# Altium schematic sheet MCU.SchDoc: AusBubble : Logic & RF : MCU
size A4; DrawnBy: WR, ND; DocumentNumber: 2; Revision: A; SheetNumber: 2; SheetTotal: 5
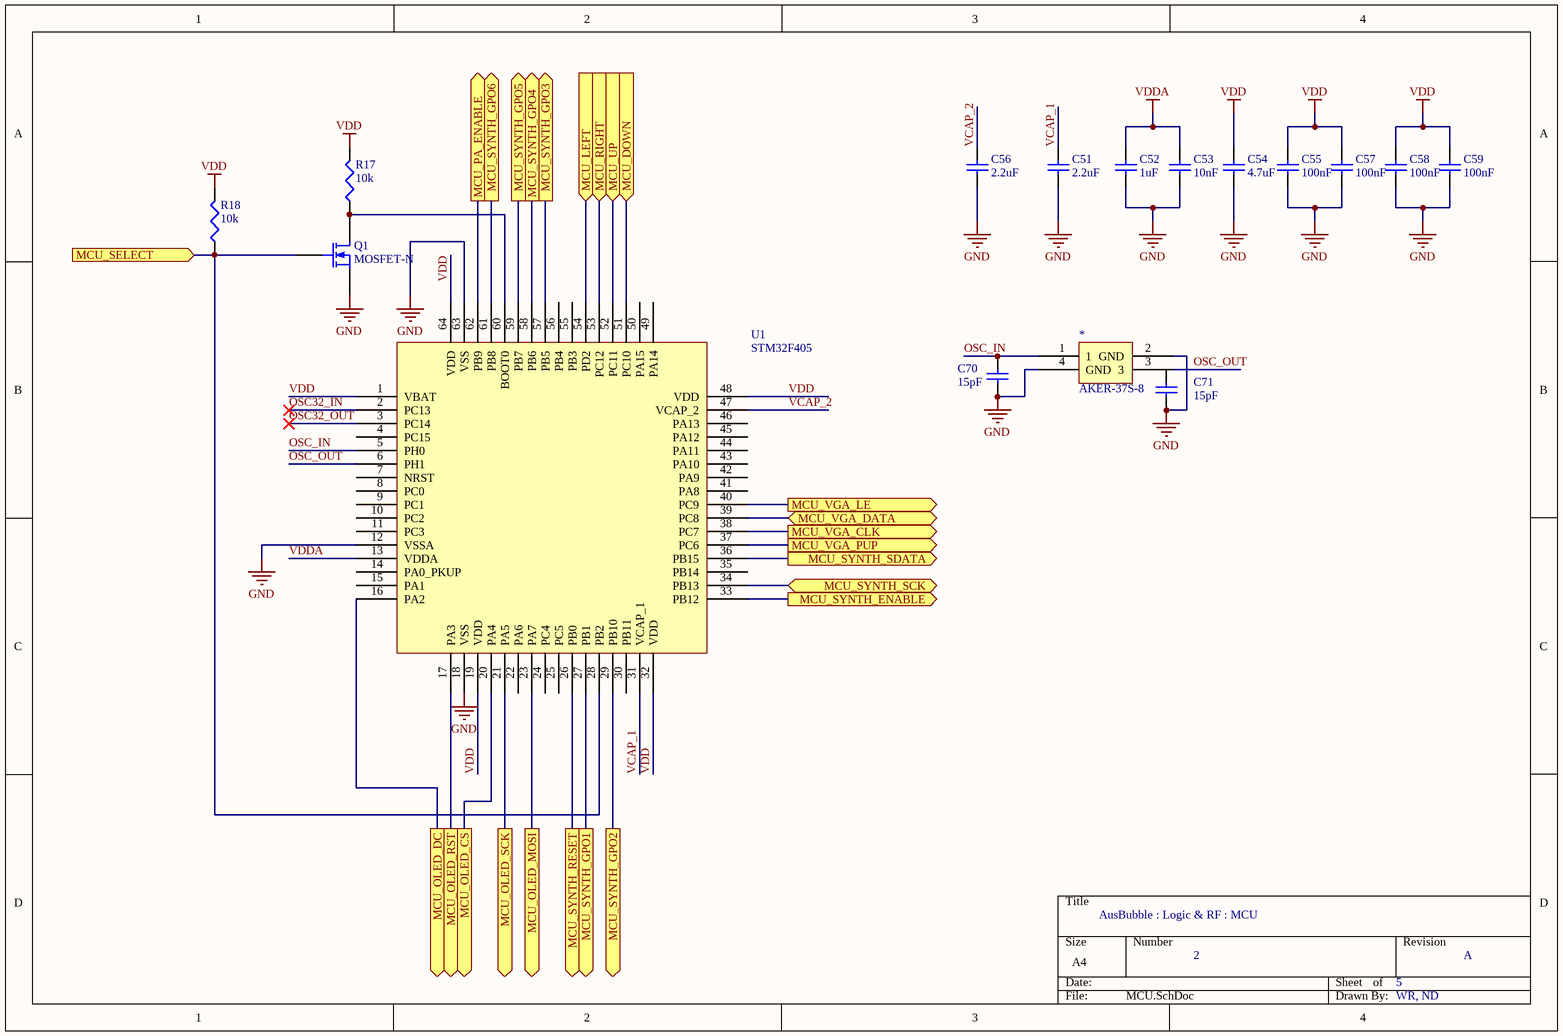
[diagram p0: MCU.SchDoc]

## Parts
*  AKER-37S-8  [AKER-37S]
C51  value 2.2uF  [1608[0603]]  (hidden comment: Cap Semi)
C52  value 1uF  [1608[0603]]  (hidden comment: Cap Semi)
C53  value 10nF  [1608[0603]]  (hidden comment: Cap Semi)
C54  value 4.7uF  [1608[0603]]  (hidden comment: Cap Semi)
C55  value 100nF  [1608[0603]]  (hidden comment: Cap Semi)
C56  value 2.2uF  [1608[0603]]  (hidden comment: Cap Semi)
C57  value 100nF  [1608[0603]]  (hidden comment: Cap Semi)
C58  value 100nF  [1608[0603]]  (hidden comment: Cap Semi)
C59  value 100nF  [1608[0603]]  (hidden comment: Cap Semi)
C70  value 15pF  [0402]  (hidden comment: Cap Semi)
C71  value 15pF  [0402]  (hidden comment: Cap Semi)
Q1  MOSFET-N  [SOT95P230-3M]
R17  value 10k  [J1-0603]  (hidden comment: Res3)
R18  value 10k  [J1-0603]  (hidden comment: Res3)
U1  STM32F405  [SQFP50P1200X1200-64L]

## Ports
MCU_DOWN (in), MCU_LEFT (in), MCU_OLED_CS (out), MCU_OLED_DC (out), MCU_OLED_MOSI (out), MCU_OLED_RST (out), MCU_OLED_SCK (out), MCU_PA_ENABLE (out), MCU_RIGHT (in), MCU_SELECT (in), MCU_SYNTH_ENABLE (out), MCU_SYNTH_GPO1 (out), MCU_SYNTH_GPO2 (out), MCU_SYNTH_GPO3 (out), MCU_SYNTH_GPO4 (out), MCU_SYNTH_GPO5 (out), MCU_SYNTH_GPO6 (out), MCU_SYNTH_RESET (out), MCU_SYNTH_SCK (bidir), MCU_SYNTH_SDATA (out), MCU_UP (in), MCU_VGA_CLK (out), MCU_VGA_DATA (bidir), MCU_VGA_LE (out), MCU_VGA_PUP (out)

## Nets
GND: *.2(GND) *.4(GND) C51.1 C52.1 C53.1 C54.1 C55.1 C56.1 C57.1 C58.1 C59.1 C70.1 C71.1 Q1.3(S) U1.12(VSSA) U1.18(VSS) U1.63(VSS)
VDD: C54.2 C55.2 C57.2 C58.2 C59.2 R17.2 R18.2 U1.1(VBAT) U1.19(VDD) U1.32(VDD) U1.48(VDD) U1.64(VDD)
VDDA: C52.2 C53.2 U1.13(VDDA)
MCU_DOWN: U1.51(PC10) ; port MCU_DOWN
MCU_LEFT: U1.54(PD2) ; port MCU_LEFT
MCU_OLED_CS: U1.20(PA4) ; port MCU_OLED_CS
MCU_OLED_DC: U1.16(PA2) ; port MCU_OLED_DC
MCU_OLED_MOSI: U1.23(PA7) ; port MCU_OLED_MOSI
MCU_OLED_RST: U1.17(PA3) ; port MCU_OLED_RST
MCU_OLED_SCK: U1.21(PA5) ; port MCU_OLED_SCK
MCU_PA_ENABLE: U1.62(PB9) ; port MCU_PA_ENABLE
MCU_RIGHT: U1.53(PC12) ; port MCU_RIGHT
MCU_SELECT: Q1.2(G) R18.1 U1.28(PB2) ; port MCU_SELECT
MCU_SYNTH_ENABLE: U1.33(PB12) ; port MCU_SYNTH_ENABLE
MCU_SYNTH_GPO1: U1.27(PB1) ; port MCU_SYNTH_GPO1
MCU_SYNTH_GPO2: U1.29(PB10) ; port MCU_SYNTH_GPO2
MCU_SYNTH_GPO3: U1.57(PB5) ; port MCU_SYNTH_GPO3
MCU_SYNTH_GPO4: U1.58(PB6) ; port MCU_SYNTH_GPO4
MCU_SYNTH_GPO5: U1.59(PB7) ; port MCU_SYNTH_GPO5
MCU_SYNTH_GPO6: U1.61(PB8) ; port MCU_SYNTH_GPO6
MCU_SYNTH_RESET: U1.26(PB0) ; port MCU_SYNTH_RESET
MCU_SYNTH_SCK: U1.34(PB13) ; port MCU_SYNTH_SCK
MCU_SYNTH_SDATA: U1.36(PB15) ; port MCU_SYNTH_SDATA
MCU_UP: U1.52(PC11) ; port MCU_UP
MCU_VGA_CLK: U1.38(PC7) ; port MCU_VGA_CLK
MCU_VGA_DATA: U1.39(PC8) ; port MCU_VGA_DATA
MCU_VGA_LE: U1.40(PC9) ; port MCU_VGA_LE
MCU_VGA_PUP: U1.37(PC6) ; port MCU_VGA_PUP
OSC32_IN: U1.2(PC13)
OSC32_OUT: U1.3(PC14)
OSC_IN: *.1 C70.2 U1.5(PH0)
OSC_OUT: *.3 U1.6(PH1)
VCAP_1: C51.2 U1.31(VCAP_1)
VCAP_2: C56.2 U1.47(VCAP_2)
NetQ1_1: Q1.1(D) R17.1 U1.60(BOOT0)

Not connected (* = marked no-connect by the designer): C71 2; U1 4(PC15) 7(NRST) 8(PC0) 9(PC1) 10(PC2) 11(PC3) 14(PA0_PKUP) 15(PA1) 22(PA6) 24(PC4) 25(PC5) 30(PB11) 35(PB14) 41(PA8) 42(PA9) 43(PA10) 44(PA11) 45(PA12) 46(PA13) 49(PA14) 50(PA15) 55(PB3) 56(PB4)

## Library data of the parts
C51-C59 C70 C71 = Cap Semi: Capacitor (Semiconductor SIM Model); Published: 8-Jun-2000; LatestRevisionDate: 29-May-2009; LatestRevisionNote: IPC-7351 Footprint Added.; PackageReference: C1206; Publisher: Altium Limited; PackageDescription: Chip Capacitor
Q1 = MOSFET-N: N-Channel MOSFET; Published: 8-Jun-2000; LatestRevisionDate: 17-Jul-2002; LatestRevisionNote: Re-released for DXP Platform.; PackageVersion: 1995/1996; PackageReference: E3; Publisher: Altium Limited; PackageDescription: TO, Flat Index; 3 In-Line, Axial Leads; Body Dia. 4.6mm; Lead Dia. 0.5 mm (max)
R17 R18 = Res3: Resistor; Published: 8-Jun-2000; LatestRevisionDate: 29-May-2009; LatestRevisionNote: IPC-7351 Footprint Added.; PackageReference: J1-0603; Publisher: Altium Limited; PackageDescription: Chip Resistor
U1 = STM32F405RG: ARM Cortex-M4 32 bit Microprocessor